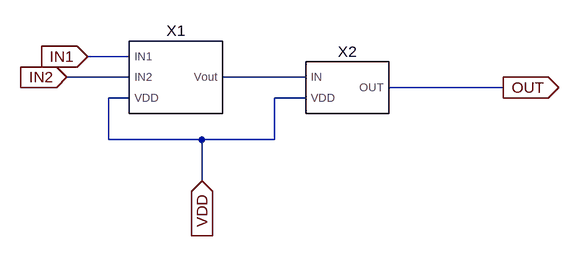
[diagram p0: schematic OR2.asc]
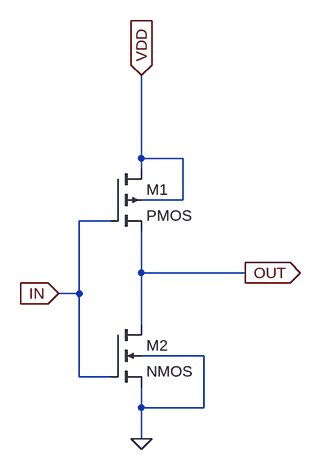
[diagram p1: sub-circuit not1.asc]
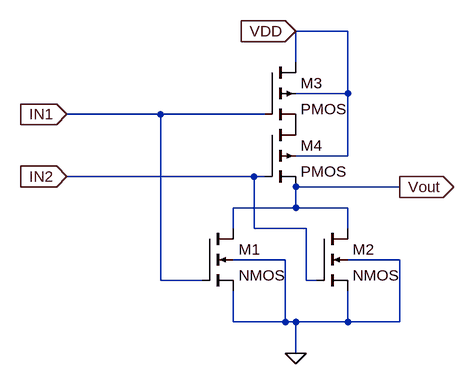
[diagram p2: sub-circuit nor2.asc]
OR2.asc, the LTspice schematic file:
Version 4.1
SHEET 1 880 680
WIRE -16 128 -80 128
WIRE -16 160 -112 160
WIRE 256 160 128 160
WIRE 560 176 384 176
WIRE -16 192 -48 192
WIRE 256 192 208 192
WIRE -48 256 -48 192
WIRE 96 256 -48 256
WIRE 208 256 208 192
WIRE 208 256 96 256
WIRE 96 320 96 256
FLAG -80 128 IN1
IOPIN -80 128 In
FLAG -112 160 IN2
IOPIN -112 160 In
FLAG 560 176 OUT
IOPIN 560 176 Out
FLAG 96 320 VDD
IOPIN 96 320 In
SYMBOL NOT1 320 176 R0
SYMATTR InstName X2
SYMBOL NOR2 48 160 R0
SYMATTR InstName X1

not1.asc, the sub-circuit schematic file:
Version 4.1
SHEET 1 880 680
WIRE 240 176 240 48
WIRE 304 176 240 176
WIRE 240 192 240 176
WIRE 304 240 304 176
WIRE 304 240 240 240
WIRE 192 272 144 272
WIRE 240 352 240 288
WIRE 400 352 240 352
WIRE 144 384 144 272
WIRE 144 384 112 384
WIRE 240 432 240 352
WIRE 336 480 240 480
WIRE 144 512 144 384
WIRE 192 512 144 512
WIRE 240 560 240 528
WIRE 336 560 336 480
WIRE 336 560 240 560
WIRE 240 608 240 560
FLAG 240 608 0
FLAG 112 384 IN
IOPIN 112 384 In
FLAG 400 352 OUT
IOPIN 400 352 Out
FLAG 240 48 VDD
IOPIN 240 48 In
SYMBOL pmos4 192 192 R0
SYMATTR InstName M1
SYMBOL nmos4 192 432 R0
SYMATTR InstName M2

nor2.asc, the sub-circuit schematic file:
Version 4.1
SHEET 1 880 680
WIRE 352 0 272 0
WIRE 272 48 272 0
WIRE 352 96 352 0
WIRE 352 96 272 96
WIRE 64 128 -80 128
WIRE 224 128 64 128
WIRE 352 192 352 96
WIRE 352 192 272 192
WIRE 208 224 -80 224
WIRE 224 224 208 224
WIRE 432 240 272 240
WIRE 272 272 272 240
WIRE 272 272 176 272
WIRE 352 272 272 272
WIRE 176 304 176 272
WIRE 208 304 208 224
WIRE 288 304 208 304
WIRE 352 304 352 272
WIRE 256 352 176 352
WIRE 432 352 352 352
WIRE 64 384 64 128
WIRE 128 384 64 384
WIRE 288 384 288 304
WIRE 304 384 288 384
WIRE 176 448 176 400
WIRE 256 448 256 352
WIRE 256 448 176 448
WIRE 272 448 256 448
WIRE 352 448 352 400
WIRE 352 448 272 448
WIRE 432 448 432 352
WIRE 432 448 352 448
WIRE 272 496 272 448
FLAG 272 496 0
FLAG 432 240 Vout
IOPIN 432 240 Out
FLAG 272 0 VDD
IOPIN 272 0 In
FLAG -80 128 IN1
IOPIN -80 128 In
FLAG -80 224 IN2
IOPIN -80 224 In
SYMBOL nmos4 128 304 R0
SYMATTR InstName M1
SYMBOL nmos4 304 304 R0
SYMATTR InstName M2
SYMBOL pmos4 224 48 R0
SYMATTR InstName M3
SYMBOL pmos4 224 144 R0
SYMATTR InstName M4

The netlist it stands for:
* OR2.asc
X§X2 N001 VDD OUT not1
X§X1 IN1 IN2 VDD N001 nor2

* block symbol definitions
.subckt not1 IN VDD OUT
M1 VDD IN OUT VDD PMOS
M2 OUT IN 0 0 NMOS
.ends not1

.subckt nor2 IN1 IN2 VDD Vout
M1 Vout IN1 0 0 NMOS
M2 Vout IN2 0 0 NMOS
M3 VDD IN1 P001 VDD PMOS
M4 P001 IN2 Vout VDD PMOS
.ends nor2

.model NMOS NMOS
.model PMOS PMOS
.lib standard.mos
.backanno
.end